# EAGLE design button8x-v1 (EAGLE 8.7.1)
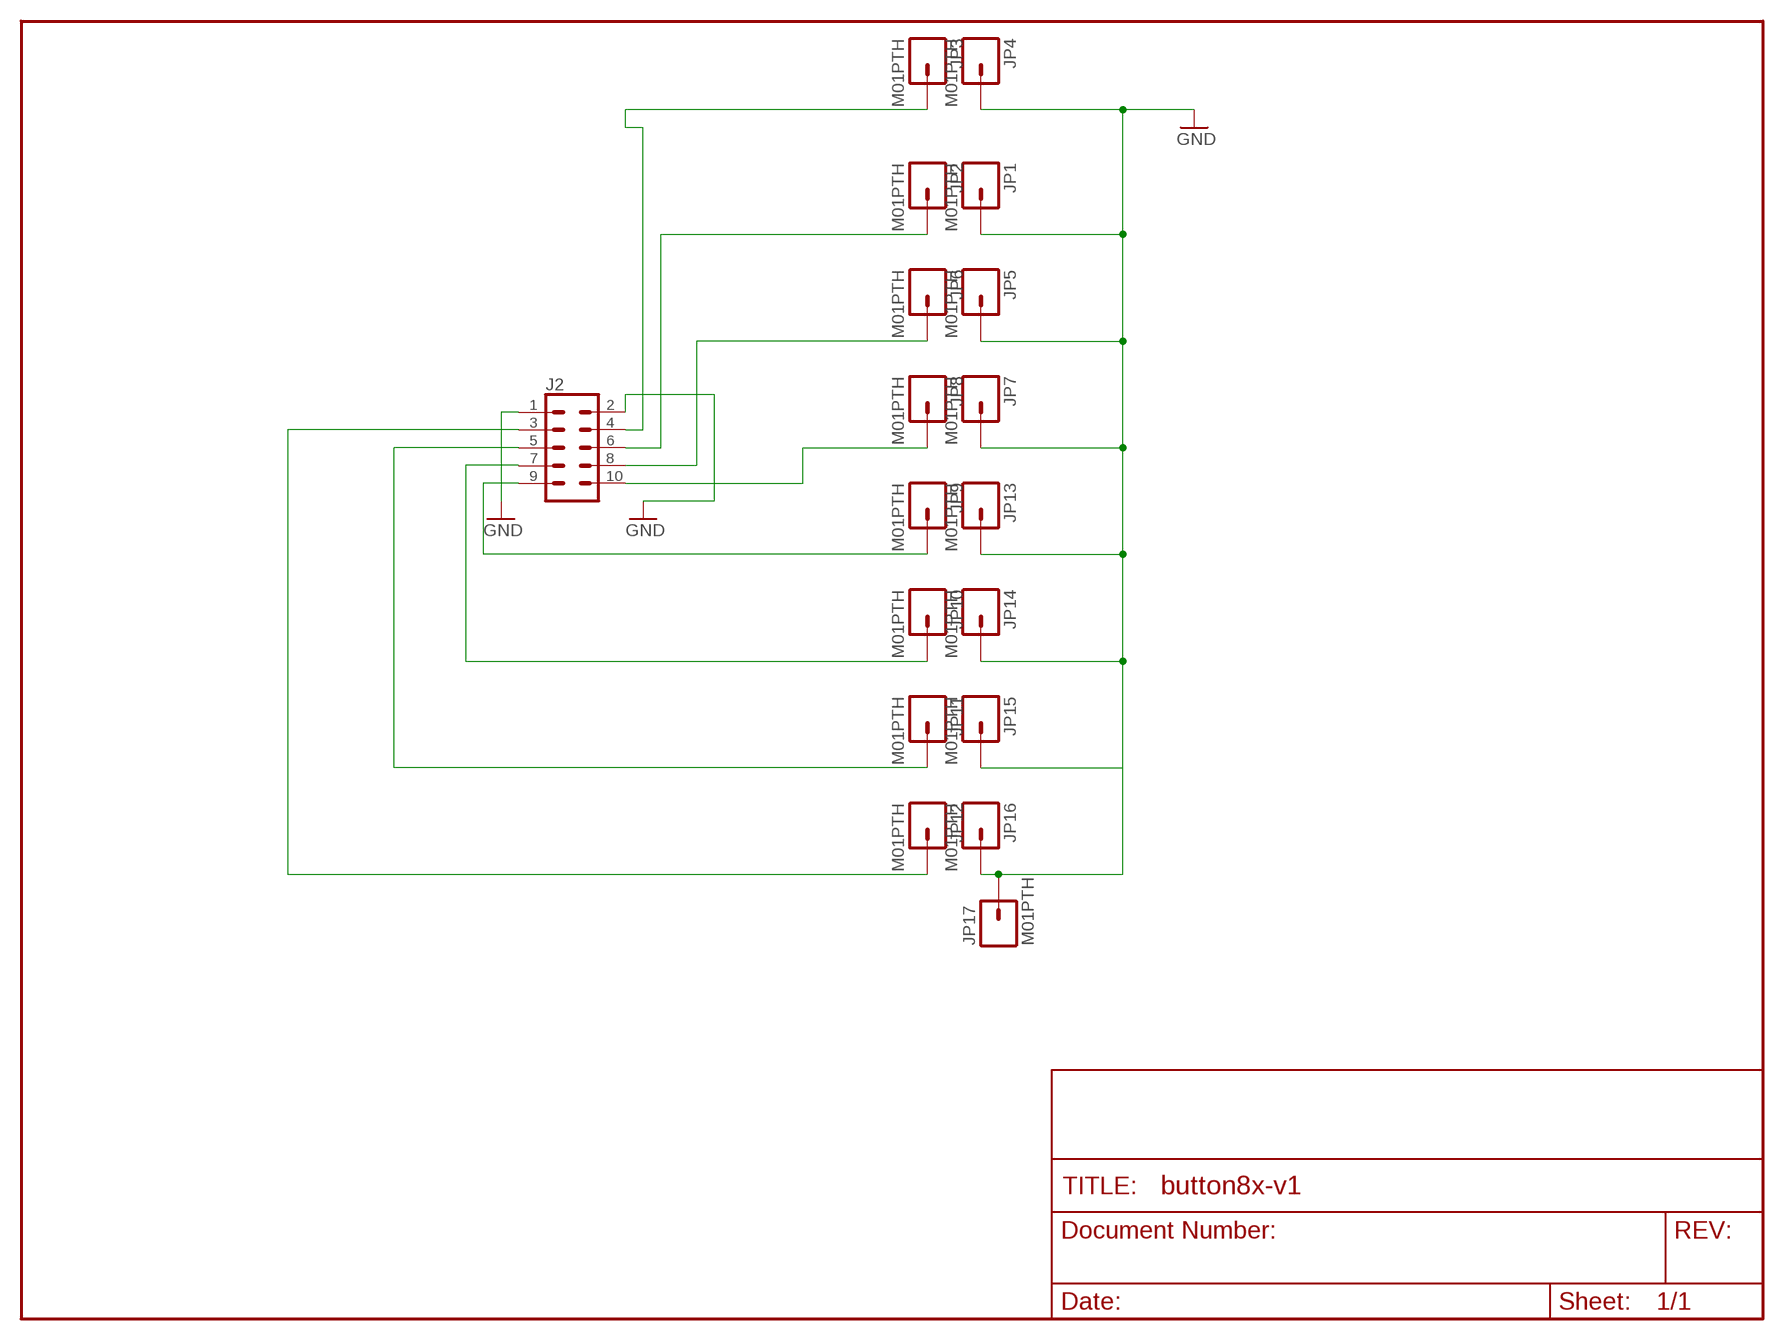
[diagram p0: schematic, sheet 1]

## Parts
J2  CONN_05X2PTH  [2X5]
JP1  M01PTH  [1X01]
JP2  M01PTH  [1X01]
JP3  M01PTH  [1X01]
JP4  M01PTH  [1X01]
JP5  M01PTH  [1X01]
JP6  M01PTH  [1X01]
JP7  M01PTH  [1X01]
JP8  M01PTH  [1X01]
JP9  M01PTH  [1X01]
JP10  M01PTH  [1X01]
JP11  M01PTH  [1X01]
JP12  M01PTH  [1X01]
JP13  M01PTH  [1X01]
JP14  M01PTH  [1X01]
JP15  M01PTH  [1X01]
JP16  M01PTH  [1X01]
JP17  M01PTH  [1X01]

## Nets
BUTTON: JP4.1
GND: J2.1 J2.2 JP1.1 JP5.1 JP7.1 JP13.1 JP14.1 JP15.1 JP16.1 JP17.1
N$1: J2.4 JP3.1
N$4: J2.6 JP2.1
N$5: J2.8 JP6.1
N$6: J2.10 JP8.1
N$7: J2.9 JP9.1
N$8: J2.7 JP10.1
N$9: J2.5 JP11.1
N$10: J2.3 JP12.1

## Library data of the parts
J2 = SparkFun-Connectors:CONN_05X2: Multi connection point. Often used as Generic Header-pin footprint for 0.1 inch spaced/style header connections For AVR SPI programming port, see special device with nice symbol: "AVR_SPI_PROG_5x2.dev" You can populate with any combo of single row headers, but if you'd like an exact match, check these: 2x5 AVR ICSP Male Header <https://www.sparkfun.com/products/778> (PRT-00778) 2x5 Pin Shrouded Header <https://www.sparkfun.com/products/8506> (PRT-08506) On any of the 0.1 inch spaced packages, you can populate with these: Break Away Headers - Straight <https://www.sparkfun.com/products/116> (PRT-00116) Break Away Male Headers - Right Angle <https://www.sparkfun.com/products/553> (PRT-00553) Female Headers <https://www.sparkfun.com/products/115> (PRT-00115) Break Away Headers - Machine Pin <https://www.sparkfun.com/products/117> (PRT-00117) Break Away Female Headers - Swiss Machine Pin <https://www.sparkfun.com/products/743> (PRT-00743) Special note: the shrouded connector mates well with our 5x2 ribbon cables: 2x5 Pin IDC Ribbon Cable <https://www.sparkfun.com/products/8535> (PRT-08535); PROD_ID: CONN-08499; SF_ID: PRT-0778
JP1-JP17 = SparkFun-Connectors:M01: Header 1 Standard 1-pin 0.1" header. Use with straight break away headers (SKU : PRT-00116), right angle break away headers (PRT-00553), swiss pins (PRT-00743), machine pins (PRT-00117), and female headers (PRT-00115).

## Net classes
0 default: width 0.203 mm
1 vcc: width 0.254 mm

## Board
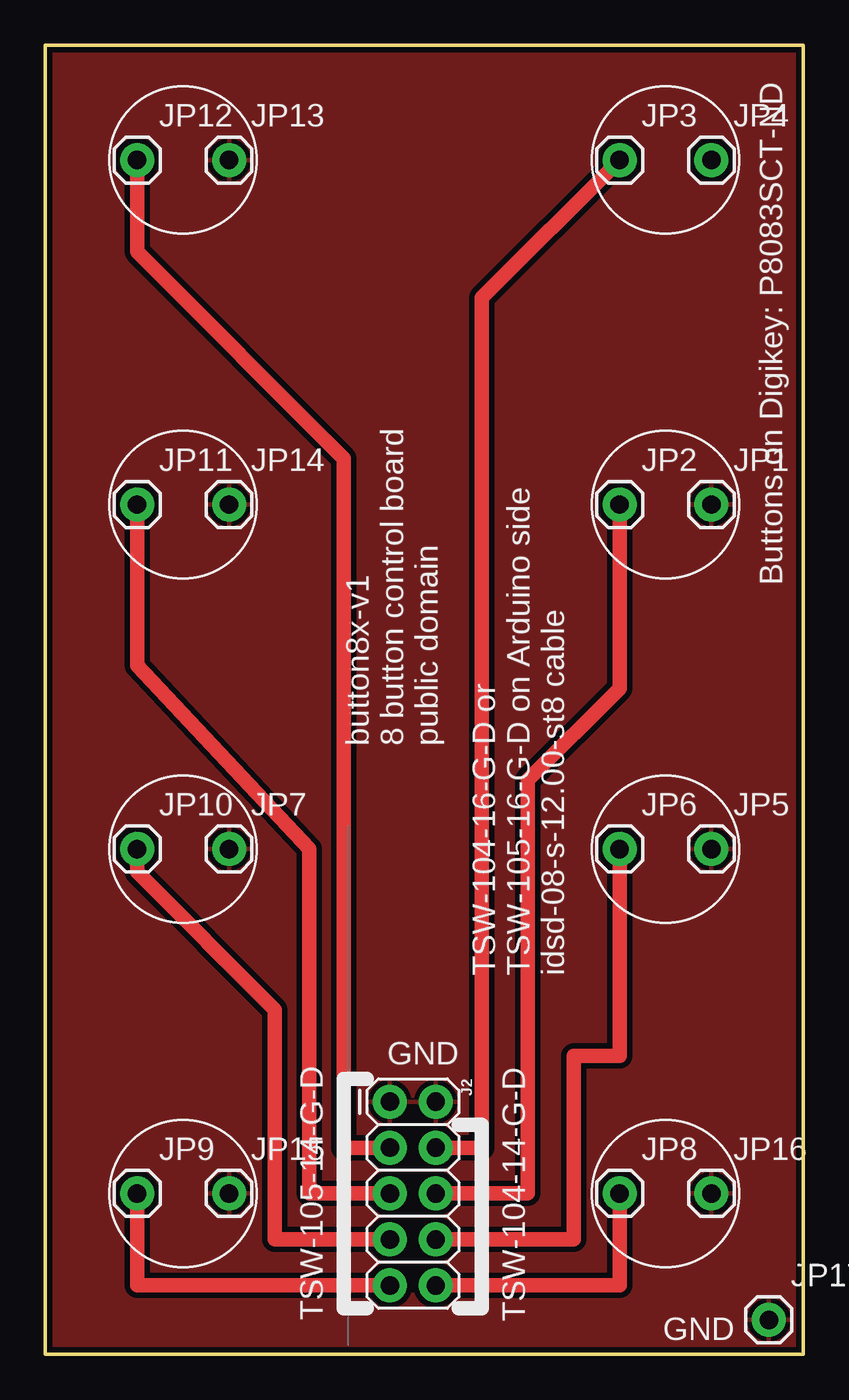
[diagram p1: board, top side]
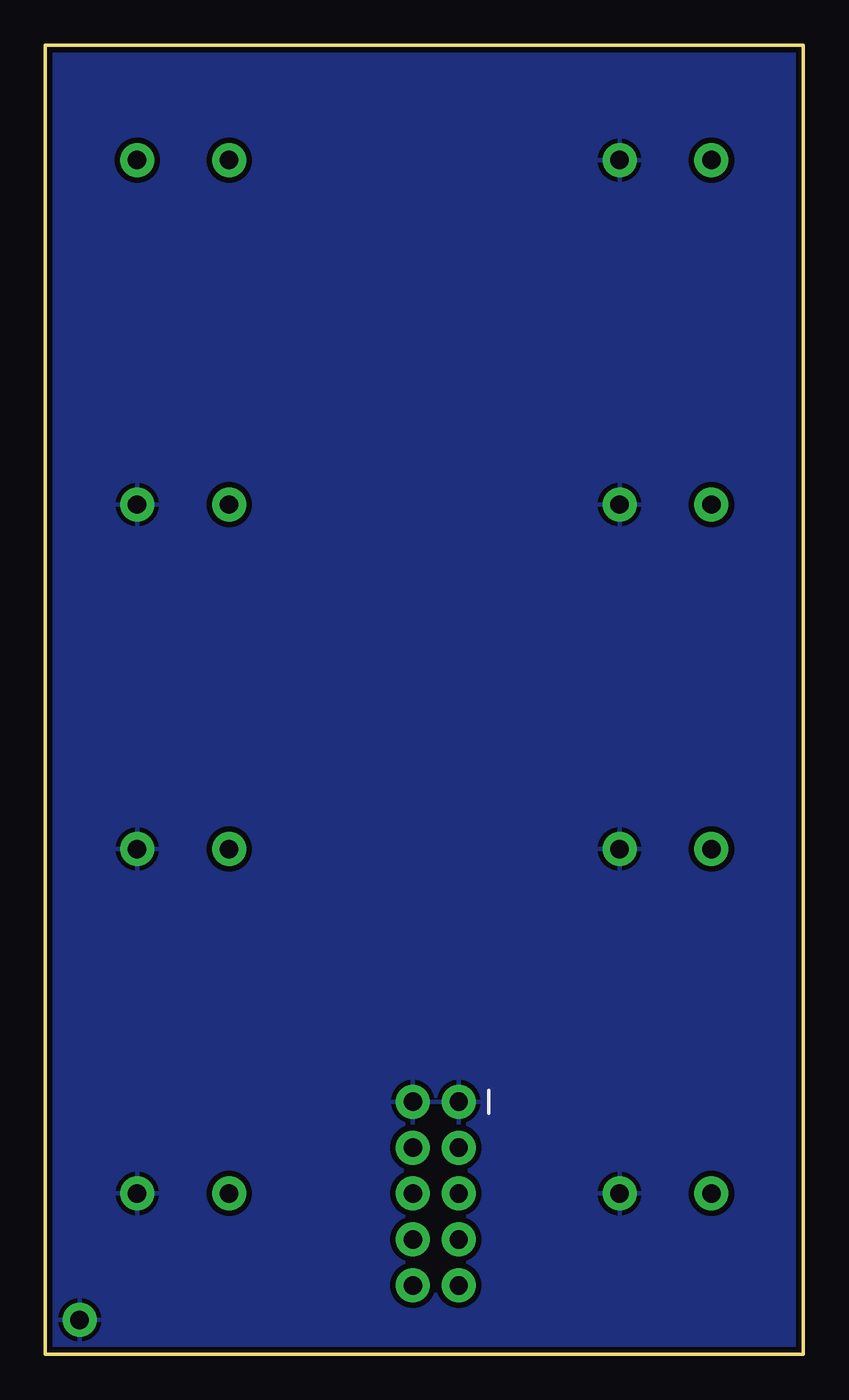
[diagram p2: board, bottom side, seen from below]

Size 41.91 x 72.39 mm. Coordinates in mm from the lower left corner, seen from the top.
Outline: 0,72.39 0,0 41.91,0 41.91,72.39 0,72.39
Copper layers (1*16): Top 0.035mm / dielectric 1.5mm / Bottom 0.035mm
Design rules "default": minimum track width 8mil, minimum drill 20mil, track to track 8mil, track to pad 8mil, pad to pad 8mil, via to via 8mil, smd to smd 8mil, copper to edge 10mil, drill to drill 8mil, minimum pad ring 12mil, minimum via ring 10mil, stop-mask expansion 4mil, vias tented up to drill 25mil, thermal gap 10mil

### Footprints (pad centres in the part's own frame; a part is rotated, then mirrored left to right if it is on the bottom)
2X5 = drill 1.016 pad 1.88: 1 0,0; 2 0,2.54; 3 2.54,0; 4 2.54,2.54; 5 5.08,0; 6 5.08,2.54; 7 7.62,0; 8 7.62,2.54; 9 10.16,0; 10 10.16,2.54
1X01 = drill 1.016 pad 1.88: 1 0,0

### Placement (x,y rotation side)
J2  19.05,13.97 270 top
JP1  36.83,46.99 0 top
JP2  31.75,46.99 0 top
JP3  31.75,66.04 0 top
JP4  36.83,66.04 0 top
JP5  36.83,27.94 0 top
JP6  31.75,27.94 0 top
JP7  10.16,27.94 0 top
JP8  31.75,8.89 0 top
JP9  5.08,8.89 0 top
JP10  5.08,27.94 0 top
JP11  5.08,46.99 0 top
JP12  5.08,66.04 0 top
JP13  10.16,66.04 0 top
JP14  10.16,46.99 0 top
JP15  10.16,8.89 0 top
JP16  36.83,8.89 0 top
JP17  40.01,1.91 0 top

### Tracks (layer width: path | path; a pad name or v marks a point on that pad's centre or on a via)
GND
  pour Top (isolate 0.305): 0,72.39 41.91,72.39 41.91,0 0,0
  pour Bottom (isolate 0.305): 0,72.39 41.91,72.39 41.91,0 0,0
N$1
  Top 0.813: J2.4 24.13,11.43 24.13,58.42 JP3.1
N$4
  Top 0.813: J2.6 26.67,8.89 26.67,31.75 31.75,36.83 JP2.1
N$5
  Top 0.813: J2.8 29.21,6.35 29.21,16.51 31.75,16.51 JP6.1
N$6
  Top 0.813: J2.10 31.75,3.81 JP8.1
N$7
  Top 0.813: J2.9 5.08,3.81 JP9.1
N$8
  Top 0.813: J2.7 12.7,6.35 12.7,19.05 5.08,26.67 JP10.1
N$9
  Top 0.813: J2.5 14.61,8.89 14.61,27.94 5.08,38.1 JP11.1
N$10
  Top 0.813: J2.3 16.51,11.43 16.51,49.53 5.08,60.96 JP12.1

### Text on the board
tPlace: Buttons on Digikey: P8083SCT-ND | button8x-v1 / 8 button control board / public domain | TSW-104-16-G-D or / TSW-105-16-G-D on Arduino side / idsd-08-s-12.00-st8 cable | GND | TSW-104-14-G-D | TSW-105-14-G-D | GND
tValues: Tent Vias! | Arduino Wee v1.3